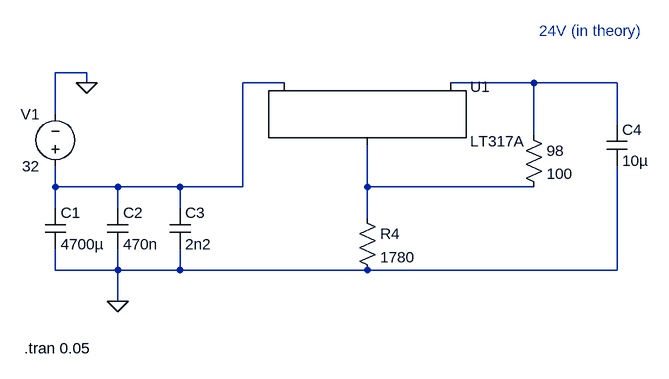
[diagram p0: schematic aristera meros.asc]
aristera meros.asc, the LTspice schematic file:
Version 4.1
SHEET 1 1032 680
WIRE -16 -144 -64 -144
WIRE -16 -128 -16 -144
WIRE 288 -128 224 -128
WIRE 672 -128 544 -128
WIRE 800 -128 672 -128
WIRE -64 -80 -64 -144
WIRE 800 -64 800 -128
WIRE 672 -48 672 -128
WIRE -64 32 -64 0
WIRE 32 32 -64 32
WIRE 128 32 32 32
WIRE 224 32 224 -128
WIRE 224 32 128 32
WIRE 416 32 416 -32
WIRE 672 32 416 32
WIRE -64 64 -64 32
WIRE 32 64 32 32
WIRE 128 64 128 32
WIRE 416 80 416 32
WIRE -64 160 -64 128
WIRE 32 160 32 128
WIRE 32 160 -64 160
WIRE 128 160 128 128
WIRE 128 160 32 160
WIRE 416 160 128 160
WIRE 800 160 800 0
WIRE 800 160 416 160
WIRE 32 208 32 160
FLAG -16 -128 0
FLAG 32 208 0
SYMBOL voltage -64 16 R180
WINDOW 0 24 96 Left 2
WINDOW 3 24 16 Left 2
WINDOW 123 0 0 Left 0
WINDOW 39 0 0 Left 0
SYMATTR InstName V1
SYMATTR Value 32
SYMBOL cap -80 64 R0
SYMATTR InstName C1
SYMATTR Value 4700µ
SYMBOL cap 16 64 R0
SYMATTR InstName C2
SYMATTR Value 470n
SYMBOL cap 112 64 R0
SYMATTR InstName C3
SYMATTR Value 2n2
SYMBOL res 656 -64 R0
SYMATTR InstName 98
SYMATTR Value 100
SYMBOL PowerProducts\\LT317A 416 -128 R0
SYMATTR InstName U1
SYMBOL res 400 64 R0
SYMATTR InstName R4
SYMATTR Value 1780
SYMBOL cap 784 -64 R0
SYMATTR InstName C4
SYMATTR Value 10µ
TEXT 680 -208 Left 2 ;24V (in theory)
TEXT -112 280 Left 2 !.tran 0.05

The netlist it stands for:
* aristera meros.asc
V1 N001 0 32
C1 N001 0 4700µ
C2 N001 0 470n
C3 N001 0 2n2
R§98 N002 N003 100
X§U1 N003 N002 N001 LT317A
R4 N003 0 1780
C4 N002 0 10µ
* 24V (in theory)
.tran 0.05
.lib LTC.lib
.backanno
.end